# Altium schematic sheet PROC.SchDoc
size A4
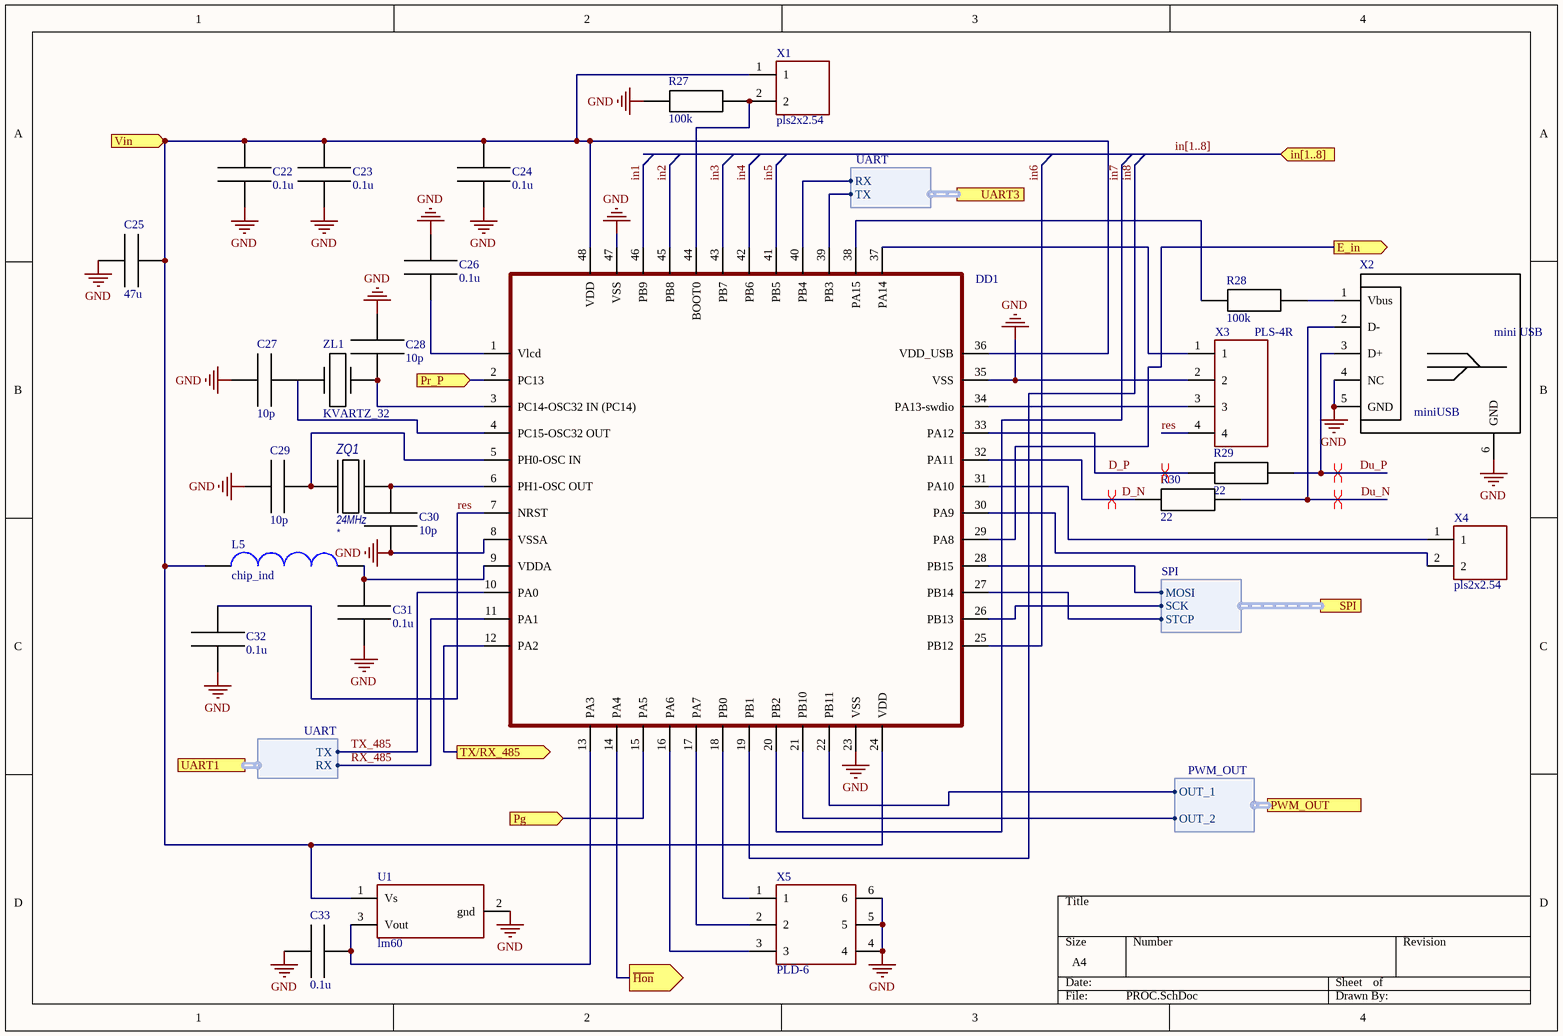
[diagram p0: PROC.SchDoc]

## Parts
C22  0.1u  [cap_0402]
C23  0.1u  [cap_0402]
C24  0.1u  [cap_0402]
C25  47u  [1206-cap]
C26  0.1u  [cap_0402]
C27  10p  [cap_0402]
C28  10p  [cap_0402]
C29  10p  [cap_0402]
C30  10p  [cap_0402]
C31  0.1u  [cap_0402]
C32  0.1u  [cap_0402]
C33  0.1u  [cap_0402]
DD1  STM32L073CBT6  [LQFP48]  (value not drawn)
L5  chip_ind  [0603_ind]
R27  100k  [res_0402]
R28  100k  [res_0402]
R29  22  [res_0402]
R30  22  [res_0402]
U1  lm60  [sot23]
X1  pls2x2.54  [pls2x2.54]
X2  miniUSB  [miniUSB]
X3  PLS-4R  [pls-4r]
X4  pls2x2.54  [pls2x2.54]
X5  PLD-6  [PLD6]
ZL1  KVARTZ_32  [zm206]
ZQ1  Type: 24MHz  [ECX-53B-DU]  (hidden comment: ESX-53-DU)

## Ports
E_in (out), in[1..8] (in), Pg (in), Pr_P (in), PWM_OUT (harness PWM_OUT), SPI (harness SPI), TX/RX_485 (out), UART1 (harness UART), UART3 (harness UART), Vin (in), ~{Hon} (out)

## Harnesses
UART: RX, TX
SPI: MOSI, SCK, STCP
PWM_OUT: OUT_1, OUT_2

## Nets
GND: C22.2 C23.2 C24.2 C25.1 C26.2 C27.2 C28.2 C29.2 C30.1 C31.2 C32.2 C33.1 DD1.8(VSSA) DD1.23(VSS) DD1.35(VSS) DD1.47(VSS) R27.1 U1.2(gnd) X2.4(NC) X2.5(GND) X2.6(GND) X3.2 X5.4 X5.5 X5.6 ZQ1.2 ZQ1.4
D_N: DD1.32(PA11) R30.1
D_P: DD1.33(PA12) R29.1
Du_N: R30.2 X2.2(D-)
Du_P: R29.2 X2.3(D+)
E_in: DD1.29(PA8) ; port E_in
~{Hon}: DD1.14(PA4) ; port ~{Hon}
in1: DD1.46(PB9)
in2: DD1.45(PB8)
in3: DD1.43(PB7)
in4: DD1.42(PB6)
in5: DD1.41(PB5)
in6: DD1.25(PB12)
in7: DD1.20(PB2)
in8: DD1.19(PB1)
Pg: DD1.15(PA5) ; port Pg
Pr_P: DD1.2(PC13) ; port Pr_P
res: C32.1 DD1.7(NRST) X3.4
RX_485: DD1.11(PA1) ; port UART1.RX
TX/RX_485: DD1.12(PA2) ; port TX/RX_485
TX_485: DD1.10(PA0) ; port UART1.TX
Vin: C22.1 C23.1 C24.1 C25.2 DD1.24(VDD) DD1.36(VDD_USB) DD1.48(VDD) L5.1 U1.1(Vs) X1.1 ; port Vin
NetC26_1: C26.1 DD1.1(Vlcd)
NetC27_1: C27.1 DD1.4(PC15-OSC32_OUT) ZL1.2
NetC28_1: C28.1 DD1.3(PC14-OSC32_IN_(PC14)) ZL1.1
NetC29_1: C29.1 DD1.5(PH0-OSC_IN) ZQ1.1
NetC30_2: C30.2 DD1.6(PH1-OSC_OUT) ZQ1.3
NetC31_1: C31.1 DD1.9(VDDA) L5.2
NetC33_2: C33.2 DD1.13(PA3) U1.3(Vout)
NetDD1_16: DD1.16(PA6) X5.3
NetDD1_17: DD1.17(PA7) X5.2
NetDD1_18: DD1.18(PB0) X5.1
NetDD1_21: DD1.21(PB10) ; port PWM_OUT.OUT_2
NetDD1_22: DD1.22(PB11) ; port PWM_OUT.OUT_1
NetDD1_26: DD1.26(PB13) ; port SPI.SCK
NetDD1_27: DD1.27(PB14) ; port SPI.STCP
NetDD1_28: DD1.28(PB15) ; port SPI.MOSI
NetDD1_30: DD1.30(PA9) X4.2
NetDD1_31: DD1.31(PA10) X4.1
NetDD1_34: DD1.34(PA13-swdio) X3.3
NetDD1_37: DD1.37(PA14) X3.1
NetDD1_38: DD1.38(PA15) R28.1
NetDD1_39: DD1.39(PB3) ; port UART3.TX
NetDD1_40: DD1.40(PB4) ; port UART3.RX
NetDD1_44: DD1.44(BOOT0) R27.2 X1.2
NetR28_2: R28.2 X2.1(Vbus)

## Buses and harness runs
bus in[1..8] = port in[1..8]

## Layout directives
differential pair: D_N, D_P, Du_N, Du_P

## Notes on the sheet
- (in symbol miniUSB) mini USB

## Library data of the parts
C22-C33 = cap
L5 = ind
R27-R30 = res
ZQ1 = REZONATOR: Crystal; Value: *